# EAGLE design board (EAGLE 9.3.1)
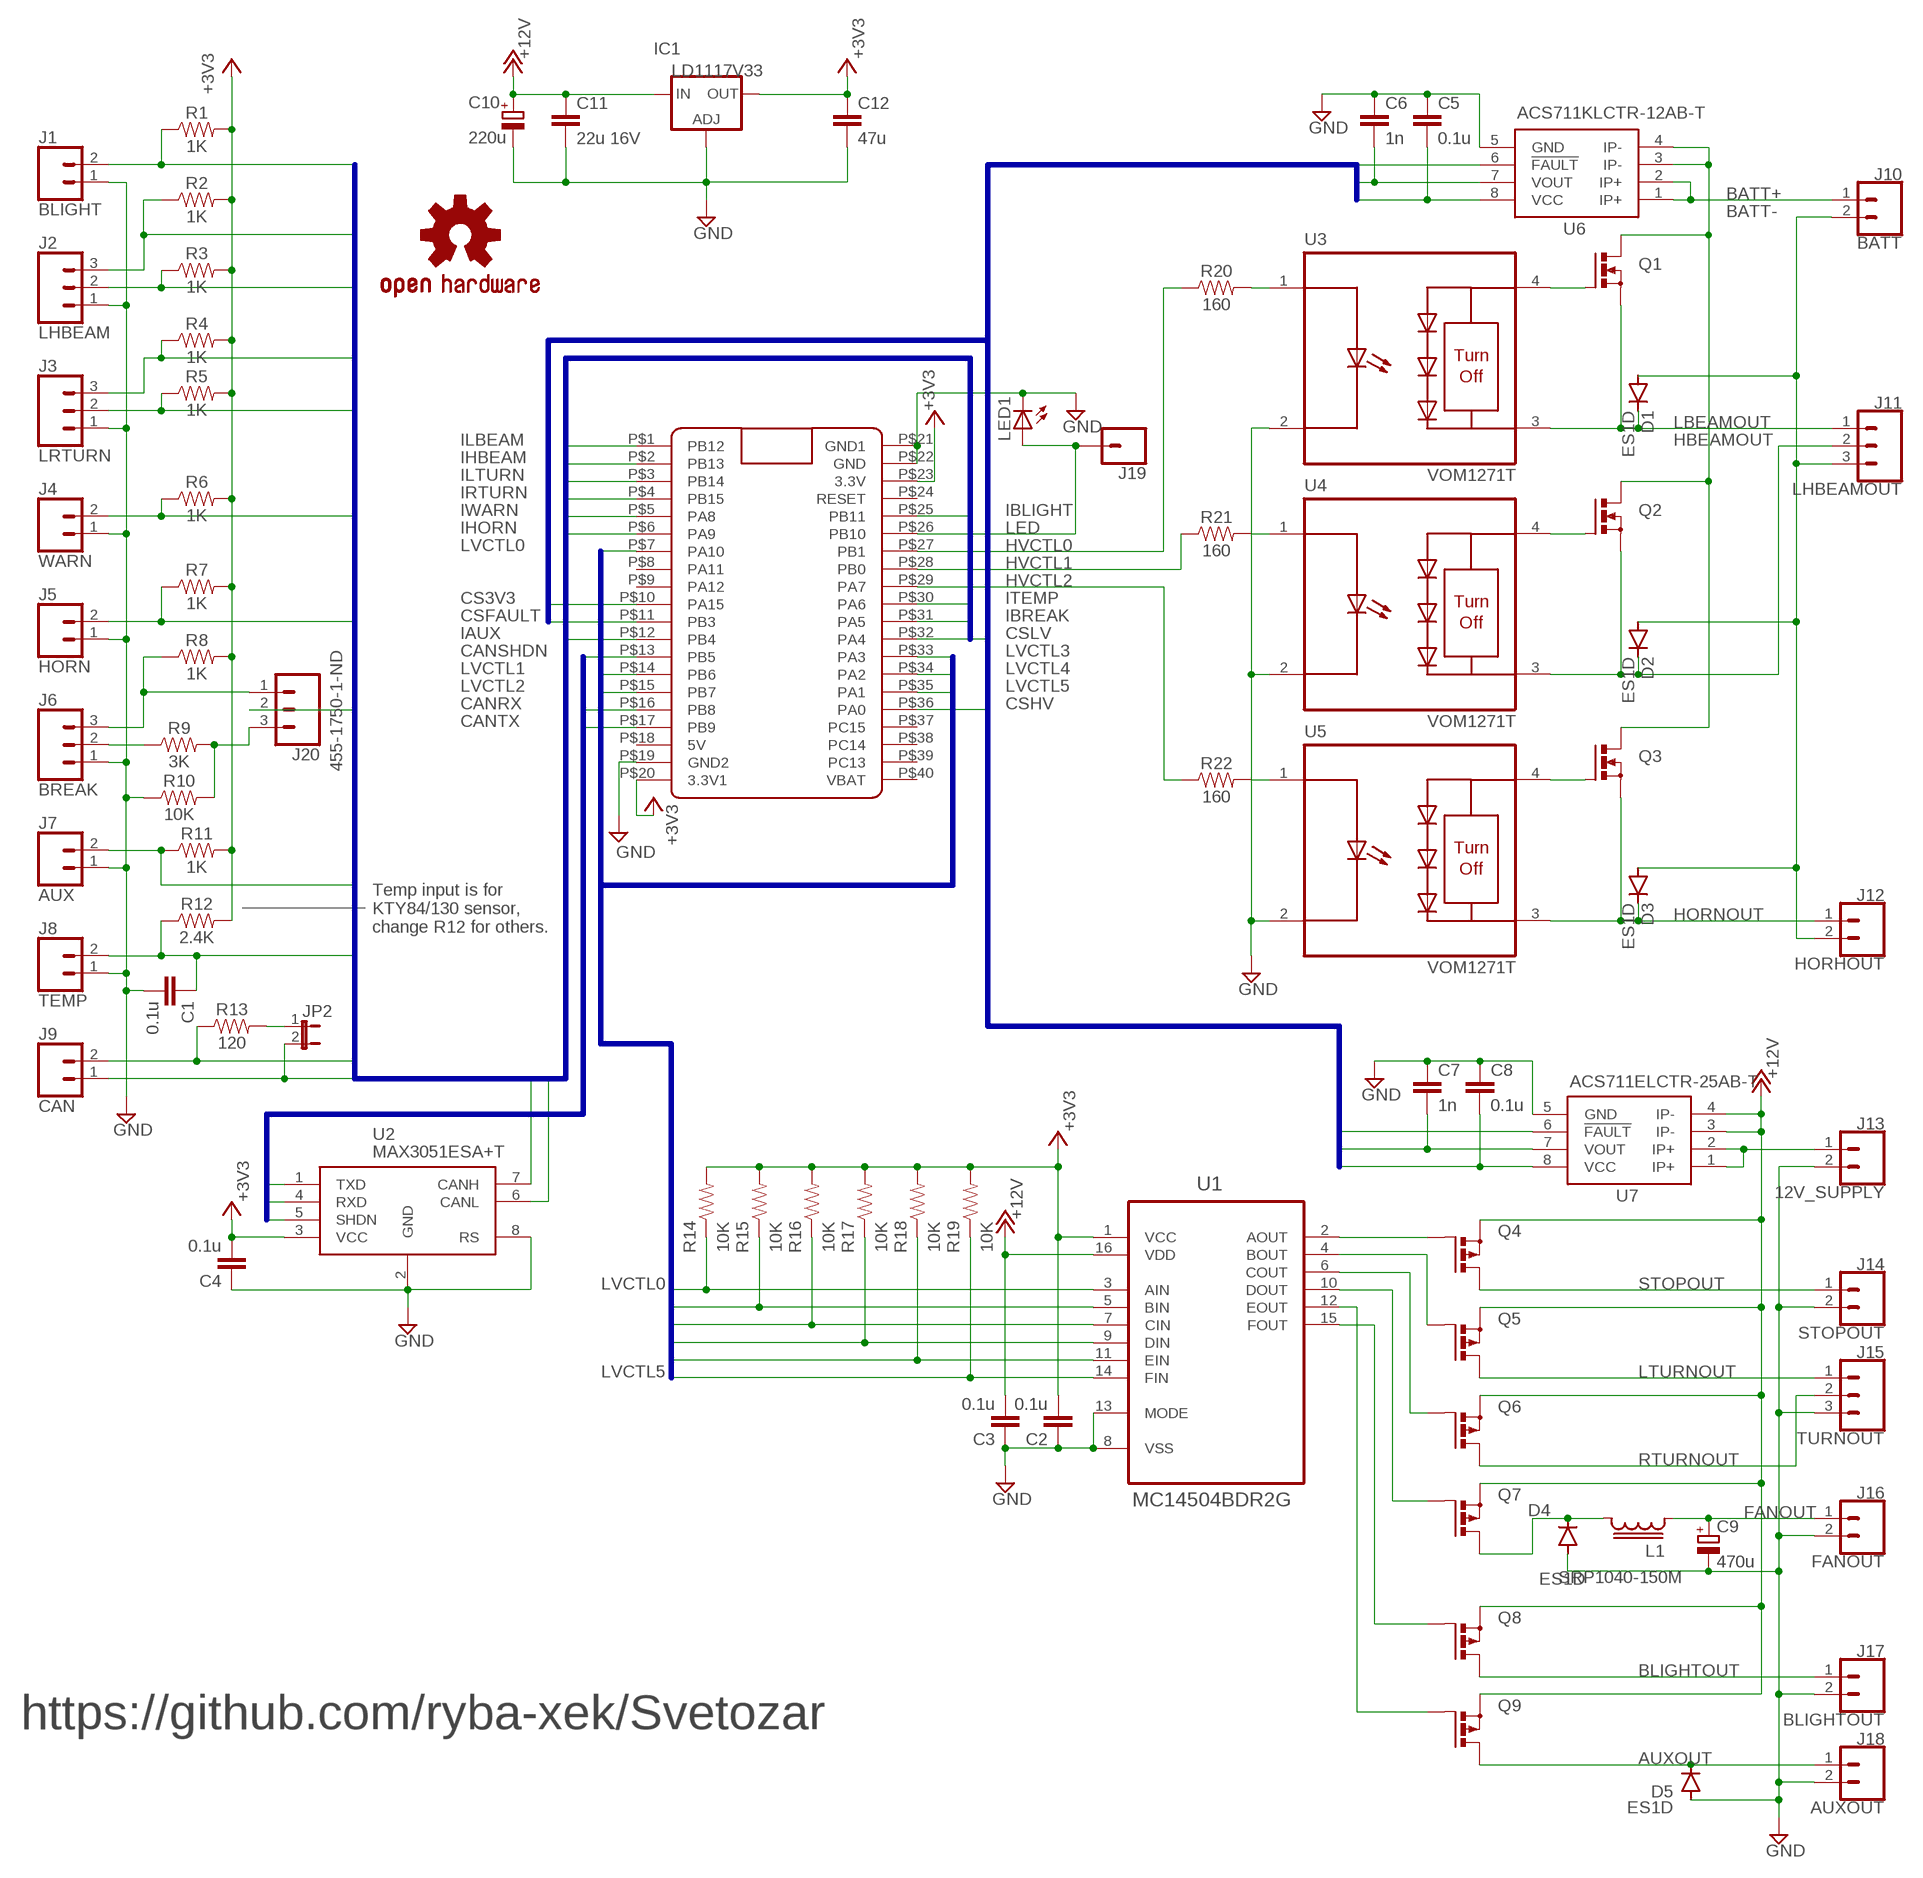
[diagram p0: schematic, sheet 1]

## Parts
C1  0.1u  C-EUC0805  [C0805]
C2  0.1u  C-EUC0805  [C0805]
C3  0.1u  C-EUC1206  [C1206]
C4  0.1u  C-EUC0805  [C0805]
C5  0.1u  C-EUC0805  [C0805]
C6  1n  C-EUC0805  [C0805]
C7  1n  C-EUC0805  [C0805]
C8  0.1u  C-EUC0805  [C0805]
C9  470u  CPOL-EUE3.5-8  [E3,5-8]
C10  220u  CPOL-EUE2.5-6  [E2,5-6]
C11  22u 16V  C-EUC1206  [C1206]
C12  47u  C-EUC1206  [C1206]
D1  ES1D  DIODE-DO214AC  [DO214AC]
D2  ES1D  DIODE-DO214AC  [DO214AC]
D3  ES1D  DIODE-DO214AC  [DO214AC]
D4  ES1D  DIODE-DO214AC  [DO214AC]
D5  ES1D  DIODE-DO214AC  [DO214AC]
IC1  LD1117V33  LD117ADT33TR  [DPACK]
J1  BLIGHT  CONN_023.5MM  [SCREWTERMINAL-3.5MM-2]
J2  LHBEAM  CONN_03SCREW  [SCREWTERMINAL-3.5MM-3]
J3  LRTURN  CONN_03SCREW  [SCREWTERMINAL-3.5MM-3]
J4  WARN  CONN_023.5MM  [SCREWTERMINAL-3.5MM-2]
J5  HORN  CONN_023.5MM  [SCREWTERMINAL-3.5MM-2]
J6  BREAK  CONN_03SCREW  [SCREWTERMINAL-3.5MM-3]
J7  AUX  CONN_023.5MM  [SCREWTERMINAL-3.5MM-2]
J8  TEMP  CONN_023.5MM  [SCREWTERMINAL-3.5MM-2]
J9  CAN  CONN_023.5MM  [SCREWTERMINAL-3.5MM-2]
J10  BATT  CONN_023.5MM  [SCREWTERMINAL-3.5MM-2]
J11  LHBEAMOUT  CONN_03SCREW  [SCREWTERMINAL-3.5MM-3]
J12  HORHOUT  CONN_023.5MM  [SCREWTERMINAL-3.5MM-2]
J13  12V_SUPPLY  CONN_023.5MM  [SCREWTERMINAL-3.5MM-2]
J14  STOPOUT  CONN_023.5MM  [SCREWTERMINAL-3.5MM-2]
J15  TURNOUT  CONN_03SCREW  [SCREWTERMINAL-3.5MM-3]
J16  FANOUT  CONN_023.5MM  [SCREWTERMINAL-3.5MM-2]
J17  BLIGHTOUT  CONN_023.5MM  [SCREWTERMINAL-3.5MM-2]
J18  AUXOUT  CONN_023.5MM  [SCREWTERMINAL-3.5MM-2]
J19  CONN_01  [1X01]
J20  455-1750-1-ND  CONN_03  [1X03]
JP2  JP1E  [JP1]
L1  SRP1040-150M  SRP1040  [SRP1040]
LED1  LEDSML0805  [SML0805]
LOGO1  OSHW-LOGOL  [OSHW-LOGO-L]
Q1  PHP20NQ20T  PMOSFET_NTO220BV  [TO220BV]
Q2  PHP20NQ20T  PMOSFET_NTO220BV  [TO220BV]
Q3  PHP20NQ20T  PMOSFET_NTO220BV  [TO220BV]
Q4  P-MOSFET-SO8  [SO-08]
Q5  P-MOSFET-SO8  [SO-08]
Q6  P-MOSFET-SO8  [SO-08]
Q7  P-MOSFET-SO8  [SO-08]
Q8  P-MOSFET-SO8  [SO-08]
Q9  P-MOSFET-SO8  [SO-08]
R1  1K  RESISTOR0603  [0603]
R2  1K  RESISTOR0603  [0603]
R3  1K  RESISTOR0603  [0603]
R4  1K  RESISTOR0603  [0603]
R5  1K  RESISTOR0603  [0603]
R6  1K  RESISTOR0603  [0603]
R7  1K  RESISTOR0603  [0603]
R8  1K  RESISTOR0603  [0603]
R9  3K  RESISTOR0603  [0603]
R10  10K  RESISTOR0603  [0603]
R11  1K  RESISTOR0603  [0603]
R12  2.4K  RESISTOR0603  [0603]
R13  120  RESISTOR0603  [0603]
R14  10K  RESISTOR0603  [0603]
R15  10K  RESISTOR0603  [0603]
R16  10K  RESISTOR0603  [0603]
R17  10K  RESISTOR0603  [0603]
R18  10K  RESISTOR0603  [0603]
R19  10K  RESISTOR0603  [0603]
R20  160  RESISTOR0603  [0603]
R21  160  RESISTOR0603  [0603]
R22  160  RESISTOR0603  [0603]
U1  MC14504BDR2G  [SOIC127P600X175-16N]
U2  MAX3051ESA+T  [SO-08]
U3  VOM1271T  [SOIC254P695X242-4N]
U4  VOM1271T  [SOIC254P695X242-4N]
U5  VOM1271T  [SOIC254P695X242-4N]
U6  ACS711KLCTR-12AB-T  ACS711  [SO08]
U7  ACS711ELCTR-25AB-T  ACS711  [SO08]
U$1  BLUE_PILL  [BLUE_PILL]

## Nets
12V_IN: J13.1 U7.1(IP+) U7.2(IP+)
+3V3: C2.2 C4.2 C12.1 IC1.4(OUT) R1.2 R2.2 R3.2 R4.2 R5.2 R6.2 R7.2 R8.2 R11.2 R12.2 R14.2 R15.2 R16.2 R17.2 R18.2 R19.2 U1.1(VCC) U2.3(VCC) U$1.P$20(3.3V1) U$1.P$23(3.3V)
+12V: C3.2 C10.+ C11.1 IC1.3(IN) Q4.1(S) Q4.2(S) Q4.3(S) Q5.1(S) Q5.2(S) Q5.3(S) Q6.1(S) Q6.2(S) Q6.3(S) Q7.1(S) Q7.2(S) Q7.3(S) Q8.1(S) Q8.2(S) Q8.3(S) Q9.1(S) Q9.2(S) Q9.3(S) U1.16(VDD) U7.3(IP-) U7.4(IP-)
AUXOUT: D5.C J18.1 Q9.5(D) Q9.6(D) Q9.7(D) Q9.8(D)
BATT+: J10.1 U6.1(IP+) U6.2(IP+)
BATT-: D1.A D2.A D3.A J10.2 J11.3 J12.2
BLIGHTOUT: J17.1 Q8.5(D) Q8.6(D) Q8.7(D) Q8.8(D)
CANH: J9.1 JP2.2 U2.7(CANH)
CANL: J9.2 R13.1 U2.6(CANL)
CANRX: U2.4(RXD) U$1.P$16(PB8)
CANSHDN: U2.5(SHDN) U$1.P$13(PB5)
CANTX: U2.1(TXD) U$1.P$17(PB9)
CS3V3: C5.2 C8.2 U6.8(VCC) U7.8(VCC) U$1.P$10(PA15)
CSFAULT: U6.6(!FAULT) U7.6(!FAULT) U$1.P$11(PB3)
CSHV: C6.2 U6.7(VOUT) U$1.P$36(PA0)
CSLV: C7.2 U7.7(VOUT) U$1.P$32(PA4)
FANOUT: C9.+ J16.1 L1.1
FANPWM: D4.C L1.2 Q7.5(D) Q7.6(D) Q7.7(D) Q7.8(D)
GND: C1.2 C2.1 C3.1 C4.1 C5.1 C6.1 C7.1 C8.1 C9.- C10.- C11.2 C12.2 D4.A D5.A IC1.1(ADJ) J1.1 J2.1 J3.1 J4.1 J5.1 J6.1 J7.1 J8.1 J13.2 J14.2 J15.3 J16.2 J17.2 J18.2 LED1.C R10.1 U1.8(VSS) U1.13(MODE) U2.2(GND) U2.8(RS) U3.2(C1) U4.2(C1) U5.2(C1) U6.5(GND) U7.5(GND) U$1.P$19(GND2) U$1.P$21(GND1) U$1.P$22(GND)
HBEAMOUT: D2.C J11.2 Q2.S U4.3(C2)
HORNOUT: D3.C J12.1 Q3.S U5.3(C2)
HV: Q1.D Q2.D Q3.D U6.3(IP-) U6.4(IP-)
HVCTL0: R20.1 U$1.P$27(PB1)
HVCTL1: R21.1 U$1.P$28(PB0)
HVCTL2: R22.1 U$1.P$29(PA7)
IAUX: J7.2 R11.1 U$1.P$12(PB4)
IBLIGHT: J1.2 R1.1 U$1.P$25(PB11)
IBREAK: J20.2 U$1.P$31(PA5)
IHBEAM: J2.2 R3.1 U$1.P$2(PB13)
IHORN: J5.2 R7.1 U$1.P$6(PA9)
ILBEAM: J2.3 R2.1 U$1.P$1(PB12)
ILTURN: J3.3 R4.1 U$1.P$3(PB14)
IRTURN: J3.2 R5.1 U$1.P$4(PB15)
ITEMP: C1.1 J8.2 R12.1 U$1.P$30(PA6)
IWARN: J4.2 R6.1 U$1.P$5(PA8)
LBEAMOUT: D1.C J11.1 Q1.S U3.3(C2)
LED: J19.1 LED1.A U$1.P$26(PB10)
LTURNOUT: J15.1 Q5.5(D) Q5.6(D) Q5.7(D) Q5.8(D)
LVCTL0: R14.1 U1.3(AIN) U$1.P$7(PA10)
LVCTL1: R15.1 U1.5(BIN) U$1.P$14(PB6)
LVCTL2: R16.1 U1.7(CIN) U$1.P$15(PB7)
LVCTL3: R17.1 U1.9(DIN) U$1.P$33(PA3)
LVCTL4: R18.1 U1.11(EIN) U$1.P$34(PA2)
LVCTL5: R19.1 U1.14(FIN) U$1.P$35(PA1)
LVG0: Q4.4(G) U1.2(AOUT)
LVG1: Q5.4(G) U1.4(BOUT)
LVG2: Q6.4(G) U1.6(COUT)
LVG3: Q7.4(G) U1.10(DOUT)
LVG4: Q8.4(G) U1.15(FOUT)
LVG5: Q9.4(G) U1.12(EOUT)
N$1: J6.3 J20.1 R8.1
N$2: JP2.1 R13.2
N$3: J20.3 R9.2 R10.2
N$4: J6.2 R9.1
N$9: R20.2 U3.1(A1)
N$10: Q1.G U3.4(A2)
N$11: R21.2 U4.1(A1)
N$12: Q2.G U4.4(A2)
N$13: R22.2 U5.1(A1)
N$14: Q3.G U5.4(A2)
RTURNOUT: J15.2 Q6.5(D) Q6.6(D) Q6.7(D) Q6.8(D)
STOPOUT: J14.1 Q4.5(D) Q4.6(D) Q4.7(D) Q4.8(D)
Unconnected: U$1.P$8(PA11) U$1.P$9(PA12) U$1.P$18(5V) U$1.P$24(RESET) U$1.P$37(PC15) U$1.P$38(PC14) U$1.P$39(PC13) U$1.P$40(VBAT)

## Buses
INPUTS:CANH,CANL,IAUX,IBLIGHT,IBREAK,IHBEAM,IHORN,ILBEAM,ILTURN,IRTURN,ITEMP,IWARN
LVCTL:LVCTL[0..5]
CAN:CANRX,CANSHDN,CANTX
CS:CS3V3,CSFAULT,CSHV,CSLV

## Notes on the sheet
- Temp input is for
  KTY84/130 sensor,
  change R12 for others.
- https://github.com/ryba-xek/Svetozar

## Library data of the parts
C1 C2 C4 C5 C8 = rcl:C-EU: CAPACITOR, European symbol; MPN: CC0805KRX7R9BB104; SPICEPREFIX: C
C3 = rcl:C-EU: CAPACITOR, European symbol; MPN: CC1206KRX7R8BB104; SPICEPREFIX: C
C6 C7 = rcl:C-EU: CAPACITOR, European symbol; MPN: CL21B102KBANNNC; SPICEPREFIX: C
C9 = rcl:CPOL-EU: POLARIZED CAPACITOR, European symbol; MPN: SK016M0470B3F-0811; SPICEPREFIX: C
C10 = rcl:CPOL-EU: POLARIZED CAPACITOR, European symbol; MPN: SK016M0220BZF-0611; SPICEPREFIX: C
C11 = rcl:C-EU: CAPACITOR, European symbol; MPN: CL31A226KOHNNNE; SPICEPREFIX: C
C12 = rcl:C-EU: CAPACITOR, European symbol; MPN: CL31A476MQHNNNE; SPICEPREFIX: C
D1-D5 = diode:DIODE-: DIODE; MPN: ES1D
IC1 = v-reg:LD117A?*: Low drop fixed and adjustable positive voltage regulators 1 A Source: http://www.st.com/stonline/products/literature/ds/7194/ld1117axx.pdf; MPN: NCP1117DT33G
J1 J4 J5 J7-J10 J12-J14 J16-J18 = SparkFun-Connectors:CONN_02: Multi connection point. Often used as Generic Header-pin footprint for 0.1 inch spaced/style header connections On any of the 0.1 inch spaced packages, you can populate with these: Break Away Headers - Straight <https://www.sparkfun.com/products/116> (PRT-00116) Break Away Male Headers - Right Angle <https://www.sparkfun.com/products/553> (PRT-00553) Female Headers <https://www.sparkfun.com/products/115> (PRT-00115) Break Away Headers - Machine Pin <https://www.sparkfun.com/products/117> (PRT-00117) Break Away Female Headers - Swiss Machine Pin <https://www.sparkfun.com/products/743> (PRT-00743) For SCREWTERMINALS and SPRING TERMINALS visit here: Screw Terimnals on SparkFun.com <https://www.sparkfun.com/search/results?term=Screw+Terminals> (5mm/3.5mm/2.54mm spacing) This device is also useful as a general connection point to wire up your design to another part of your project. Our various solder wires solder well into these plated through hole pads. Hook-Up Wire - Assortment (Stranded, 22 AWG) <https://www.sparkfun.com/products/11375> (PRT-11375) Hook-Up Wire - Assortment (Solid Core, 22 AWG) <https://www.sparkfun.com/products/11367> (PRT-11367) View the entire wire category on our website here <https://www.sparkfun.com/categories/141> Special notes: Molex polarized connector foot print use with: PRT-08233 with associated crimp pins and housings. 2.54_SCREWTERM for use with PRT-10571. 3.5mm Screw Terminal footprints for PRT-08084 5mm Screw Terminal footprints for use with PRT-08432; MPN: DG350-3.5-02P-14-00AH; PROD_ID: CONN-08399
J2 J3 J6 J11 J15 = SparkFun-Connectors:CONN_03: Multi connection point. Often used as Generic Header-pin footprint for 0.1 inch spaced/style header connections On any of the 0.1 inch spaced packages, you can populate with these: Break Away Headers - Straight <https://www.sparkfun.com/products/116> (PRT-00116) Break Away Male Headers - Right Angle <https://www.sparkfun.com/products/553> (PRT-00553) Female Headers <https://www.sparkfun.com/products/115> (PRT-00115) Break Away Headers - Machine Pin <https://www.sparkfun.com/products/117> (PRT-00117) Break Away Female Headers - Swiss Machine Pin <https://www.sparkfun.com/products/743> (PRT-00743) Stackable Header - 3 Pin (Female, 0.1") <https://www.sparkfun.com/products/13875> (PRT-13875) For SCREWTERMINALS and SPRING TERMINALS visit here: Screw Terimnals on SparkFun.com <https://www.sparkfun.com/search/results?term=Screw+Terminals> (5mm/3.5mm/2.54mm spacing) This device is also useful as a general connection point to wire up your design to another part of your project. Our various solder wires solder well into these plated through hole pads. Hook-Up Wire - Assortment (Stranded, 22 AWG) <https://www.sparkfun.com/products/11375> (PRT-11375) Hook-Up Wire - Assortment (Solid Core, 22 AWG) <https://www.sparkfun.com/products/11367> (PRT-11367) View the entire wire category on our website here <https://www.sparkfun.com/categories/141> Special notes: Molex polarized connector foot print use with SKU : PRT-08232 with associated crimp pins and housings.; MPN: DG350-3.5-03P-14-00AH; PROD_ID: CONN-08288; SF_ID: PRT-08235
J19 = SparkFun-Connectors:CONN_01: Single connection point. Often used as Generic Header-pin footprint for 0.1 inch spaced/style header connections On any of the 0.1 inch spaced packages, you can populate with these: Break Away Headers - Straight <https://www.sparkfun.com/products/116> (PRT-00116) Break Away Male Headers - Right Angle <https://www.sparkfun.com/products/553> (PRT-00553) Female Headers <https://www.sparkfun.com/products/115> (PRT-00115) Break Away Headers - Machine Pin <https://www.sparkfun.com/products/117> (PRT-00117) Break Away Female Headers - Swiss Machine Pin <https://www.sparkfun.com/products/743> (PRT-00743) This device is also useful as a general connection point to wire up your design to another part of your project. Our various solder wires solder well into these plated through hole pads. Hook-Up Wire - Assortment (Stranded, 22 AWG) <https://www.sparkfun.com/products/11375> (PRT-11375) Hook-Up Wire - Assortment (Solid Core, 22 AWG) <https://www.sparkfun.com/products/11367> (PRT-11367) View the entire wire category on our website here <https://www.sparkfun.com/categories/141> Special notes: SMTSO-256-ET is a "flush mount" nut for a 4-40 screw. We mostly use this on specialty testbeds; it is a nice way to connect hardware to your PCB at an adjustable hieght. Also note, the SNAP packages are for using a snappable style connector. We sell a baggie of snaps and they are also used on two LilyPad designs: Snap Assortment - 30 pack (male and female) <https://www.sparkfun.com/products/11347> (DEV-11347) LilyPad Arduino SimpleSnap <https://www.sparkfun.com/products/10941> (DEV-10941) LilyPad SimpleSnap Protoboard <https://www.sparkfun.com/products/10940> (DEV-10940); MPN: PLS-1
J20 = SparkFun-Connectors:CONN_03: Multi connection point. Often used as Generic Header-pin footprint for 0.1 inch spaced/style header connections On any of the 0.1 inch spaced packages, you can populate with these: Break Away Headers - Straight <https://www.sparkfun.com/products/116> (PRT-00116) Break Away Male Headers - Right Angle <https://www.sparkfun.com/products/553> (PRT-00553) Female Headers <https://www.sparkfun.com/products/115> (PRT-00115) Break Away Headers - Machine Pin <https://www.sparkfun.com/products/117> (PRT-00117) Break Away Female Headers - Swiss Machine Pin <https://www.sparkfun.com/products/743> (PRT-00743) Stackable Header - 3 Pin (Female, 0.1") <https://www.sparkfun.com/products/13875> (PRT-13875) For SCREWTERMINALS and SPRING TERMINALS visit here: Screw Terimnals on SparkFun.com <https://www.sparkfun.com/search/results?term=Screw+Terminals> (5mm/3.5mm/2.54mm spacing) This device is also useful as a general connection point to wire up your design to another part of your project. Our various solder wires solder well into these plated through hole pads. Hook-Up Wire - Assortment (Stranded, 22 AWG) <https://www.sparkfun.com/products/11375> (PRT-11375) Hook-Up Wire - Assortment (Solid Core, 22 AWG) <https://www.sparkfun.com/products/11367> (PRT-11367) View the entire wire category on our website here <https://www.sparkfun.com/categories/141> Special notes: Molex polarized connector foot print use with SKU : PRT-08232 with associated crimp pins and housings.; MPN: PLS-3; PROD_ID: XXX-00000
JP2 = jumper:JP1E: JUMPER; MPN: PLS-2
L1 = inductor-bourns:SRP1040: POWER INDUCTOR; MPN: SRP1040-150M
LED1 = led:LED: LED OSRAM: - CHIPLED LG R971, LG N971, LY N971, LG Q971, LY Q971, LO R971, LY R971 LH N974, LH R974 LS Q976, LO Q976, LY Q976 LO Q996 - Hyper CHIPLED LW Q18S LB Q993, LB Q99A, LB R99A - SideLED LS A670, LO A670, LY A670, LG A670, LP A670 LB A673, LV A673, LT A673, LW A673 LH A674 LY A675 LS A676, LA A676, LO A676, LY A676, LW A676 LS A679, LY A679, LG A679 - Hyper Micro SIDELED® LS Y876, LA Y876, LO Y876, LY Y876 LT Y87S - SmartLED LW L88C, LW L88S LB L89C, LB L89S, LG L890 LS L89K, LO L89K, LY L89K LS L896, LA L896, LO L896, LY L896 - TOPLED LS T670, LO T670, LY T670, LG T670, LP T670 LSG T670, LSP T670, LSY T670, LOP T670, LYG T670 LG T671, LOG T671, LSG T671 LB T673, LV T673, LT T673, LW T673 LH T674 LS T676, LA T676, LO T676, LY T676, LB T676, LH T676, LSB T676, LW T676 LB T67C, LV T67C, LT T67C, LS T67K, LO T67K, LY T67K, LW E67C LS E67B, LA E67B, LO E67B, LY E67B, LB E67C, LV E67C, LT E67C LW T67C LS T679, LY T679, LG T679 LS T770, LO T770, LY T770, LG T770, LP T770 LB T773, LV T773, LT T773, LW T773 LH T774 LS E675, LA E675, LY E675, LS T675 LS T776, LA T776, LO T776, LY T776, LB T776 LHGB T686 LT T68C, LB T68C - Hyper Mini TOPLED® LB M676 - Mini TOPLED Santana® LG M470 LS M47K, LO M47K, LY M47K Source: http://www.osram.convergy.de LUXEON: - LUMILED® LXK2-PW12-R00, LXK2-PW12-S00, LXK2-PW14-U00, LXK2-PW14-V00 LXK2-PM12-R00, LXK2-PM12-S00, LXK2-PM14-U00 LXK2-PE12-Q00, LXK2-PE12-R00, LXK2-PE12-S00, LXK2-PE14-T00, LXK2-PE14-U00 LXK2-PB12-K00, LXK2-PB12-L00, LXK2-PB12-M00, LXK2-PB14-N00, LXK2-PB14-P00, LXK2-PB14-Q00 LXK2-PR12-L00, LXK2-PR12-M00, LXK2-PR14-Q00, LXK2-PR14-R00 LXK2-PD12-Q00, LXK2-PD12-R00, LXK2-PD12-S00 LXK2-PH12-R00, LXK2-PH12-S00 LXK2-PL12-P00, LXK2-PL12-Q00, LXK2-PL12-R00 Source: www.luxeon.com KINGBRIGHT: KA-3528ASYC Source: www.kingbright.com; MPN: KPT-2012ZGC
LOGO1 = SparkFun-Aesthetics:OSHW-LOGO: Open-Source Hardware (OSHW) Logo This logo indicates the piece of hardware it is found on incorporates a OSHW license and/or adheres to the definition of open source hardware found here: http://freedomdefined.org/OSHW
Q1-Q3 = transistor-power:PMOSFET_N: Power MOSFET N-Channel; MPN: PHP20NQ20T.127
Q4-Q9 = transistor-power:P-MOSFET-SO8: P-Channel MOSFET Example: FDS4435A; P-Channel Logic Level PowerTrench® MOSFET FDS4465; P-Channel 1.8V Specified PowerTrench® MOSFET Source: www.fairchildsemi.com; MPN: IRF7424TRPBF
R1-R8 R11 = SparkFun-Resistors:RESISTOR: Generic Resistor Package; MPN: RC0603JR-071KL
R9 = SparkFun-Resistors:RESISTOR: Generic Resistor Package; MPN: RC0603JR-073KL
R10 R14-R19 = SparkFun-Resistors:RESISTOR: Generic Resistor Package; MPN: RC0603JR-0710KL
R12 = SparkFun-Resistors:RESISTOR: Generic Resistor Package; MPN: RC0603FR-072K4L
R13 = SparkFun-Resistors:RESISTOR: Generic Resistor Package; MPN: RC0603FR-07120RL
R20-R22 = SparkFun-Resistors:RESISTOR: Generic Resistor Package; MPN: RC0603FR-07160RL
U1 = MC14504BDR2G:MC14504BDR2G: Hex Level Shifter for TTL to CMOS or CMOS to CMOS; AVAILABILITY: Unavailable; DESCRIPTION: MC14504B Series SMT Hex Level Shifter for TTL to CMOS/CMOS to CMOS - SOIC-16; MF: ON Semiconductor; MP: MC14504BDR2G; MPN: MC14504BDR2G; PACKAGE: SOIC-16 ON Semiconductor; PRICE: None
U2 = MAX3051ESA:MAX3051ESA: Can bus transciever Datasheet: http://datasheets.maximintegrated.com/en/ds/MAX3051.pdf; MPN: MAX3051ESA+T
U3-U5 = VOM1271T:VOM1271T; AVAILABILITY: Good; DESCRIPTION: Relay SSR 50mA 1.6V DC-IN 4-Pin SOP T/R; MF: Vishay Semiconductor; MP: VOM1271T; MPN: VOM1271T; PACKAGE: SOP-4 Vishay; PRICE: 1.60 USD
U6 = svetozar:ACS711: ACS711LC Hall-effect-based isolated linear current sensor Datasheet <http://www.allegromicro.com/~/media/Files/Datasheets/ACS711-Datasheet.ashx?la=en>; MPN: ACS711KLCTR-12AB-T; PROD_ID: IC-08964; VALUE: ACS711LC
U7 = svetozar:ACS711: ACS711LC Hall-effect-based isolated linear current sensor Datasheet <http://www.allegromicro.com/~/media/Files/Datasheets/ACS711-Datasheet.ashx?la=en>; MPN: ACS711ELCTR-25AB-T; PROD_ID: IC-08964; VALUE: ACS711LC
U$1 = svetozar:BLUE_PILL

## Net classes
0 default: width 0.3 mm, clearance 0.3 mm

## Board
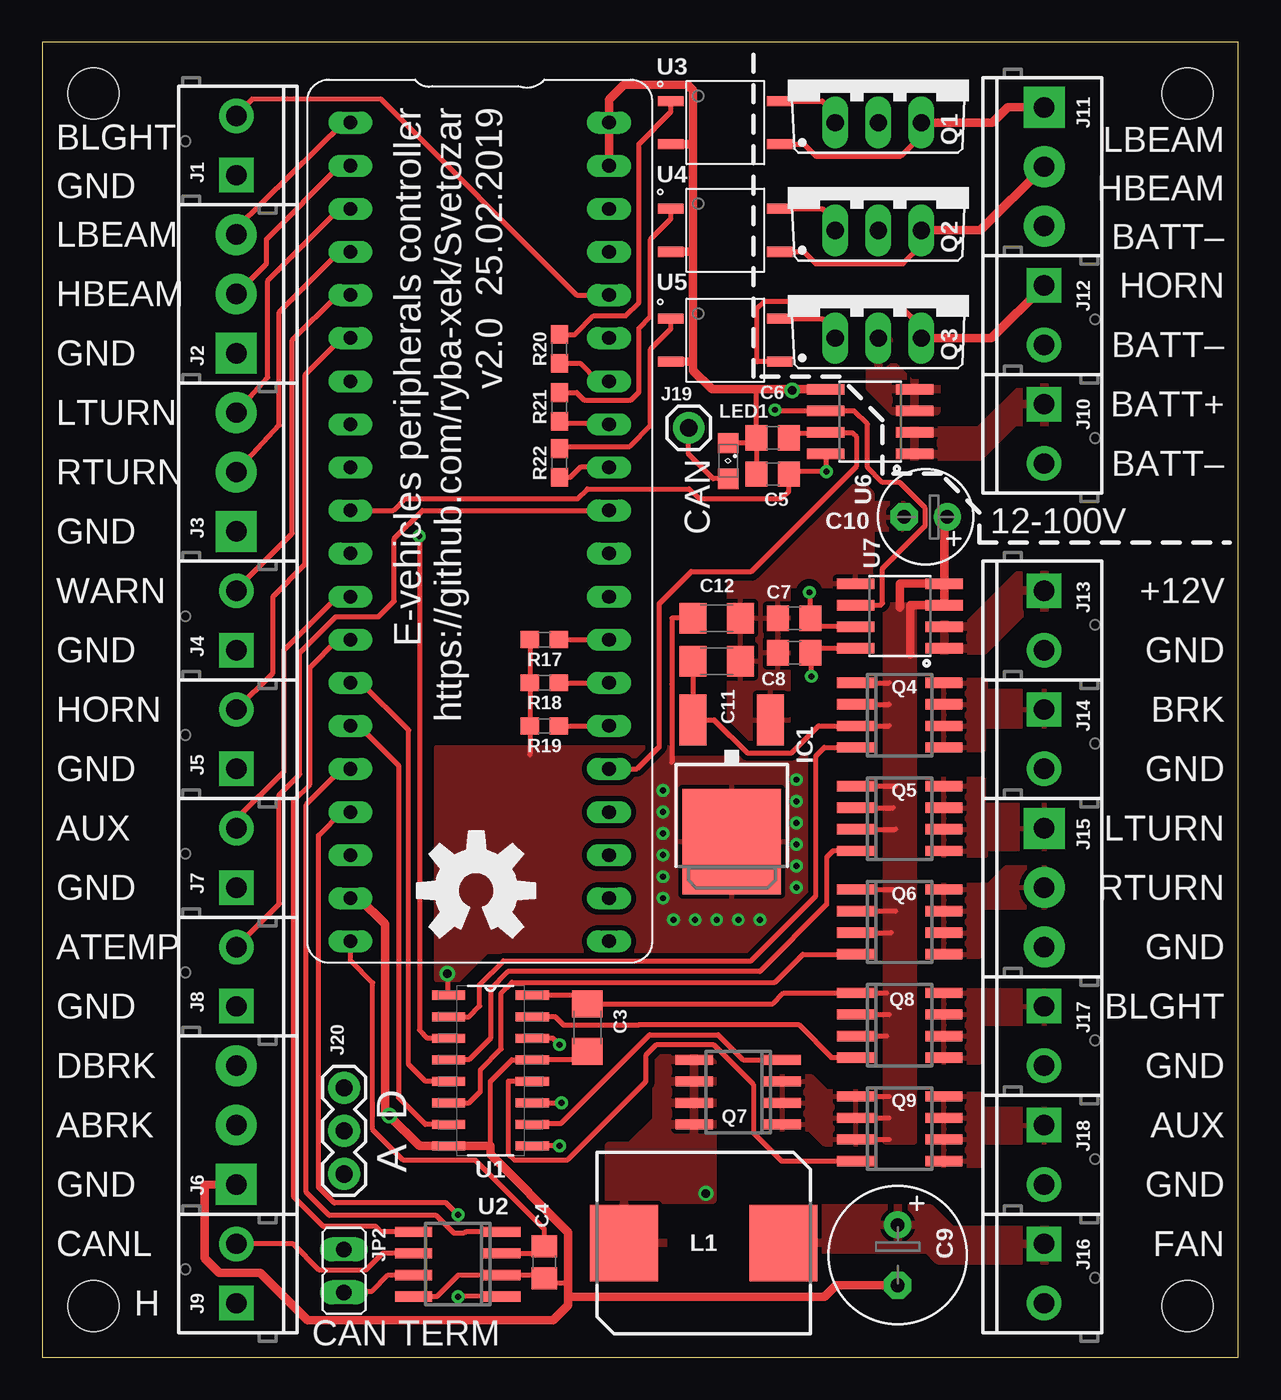
[diagram p1: board, top side]
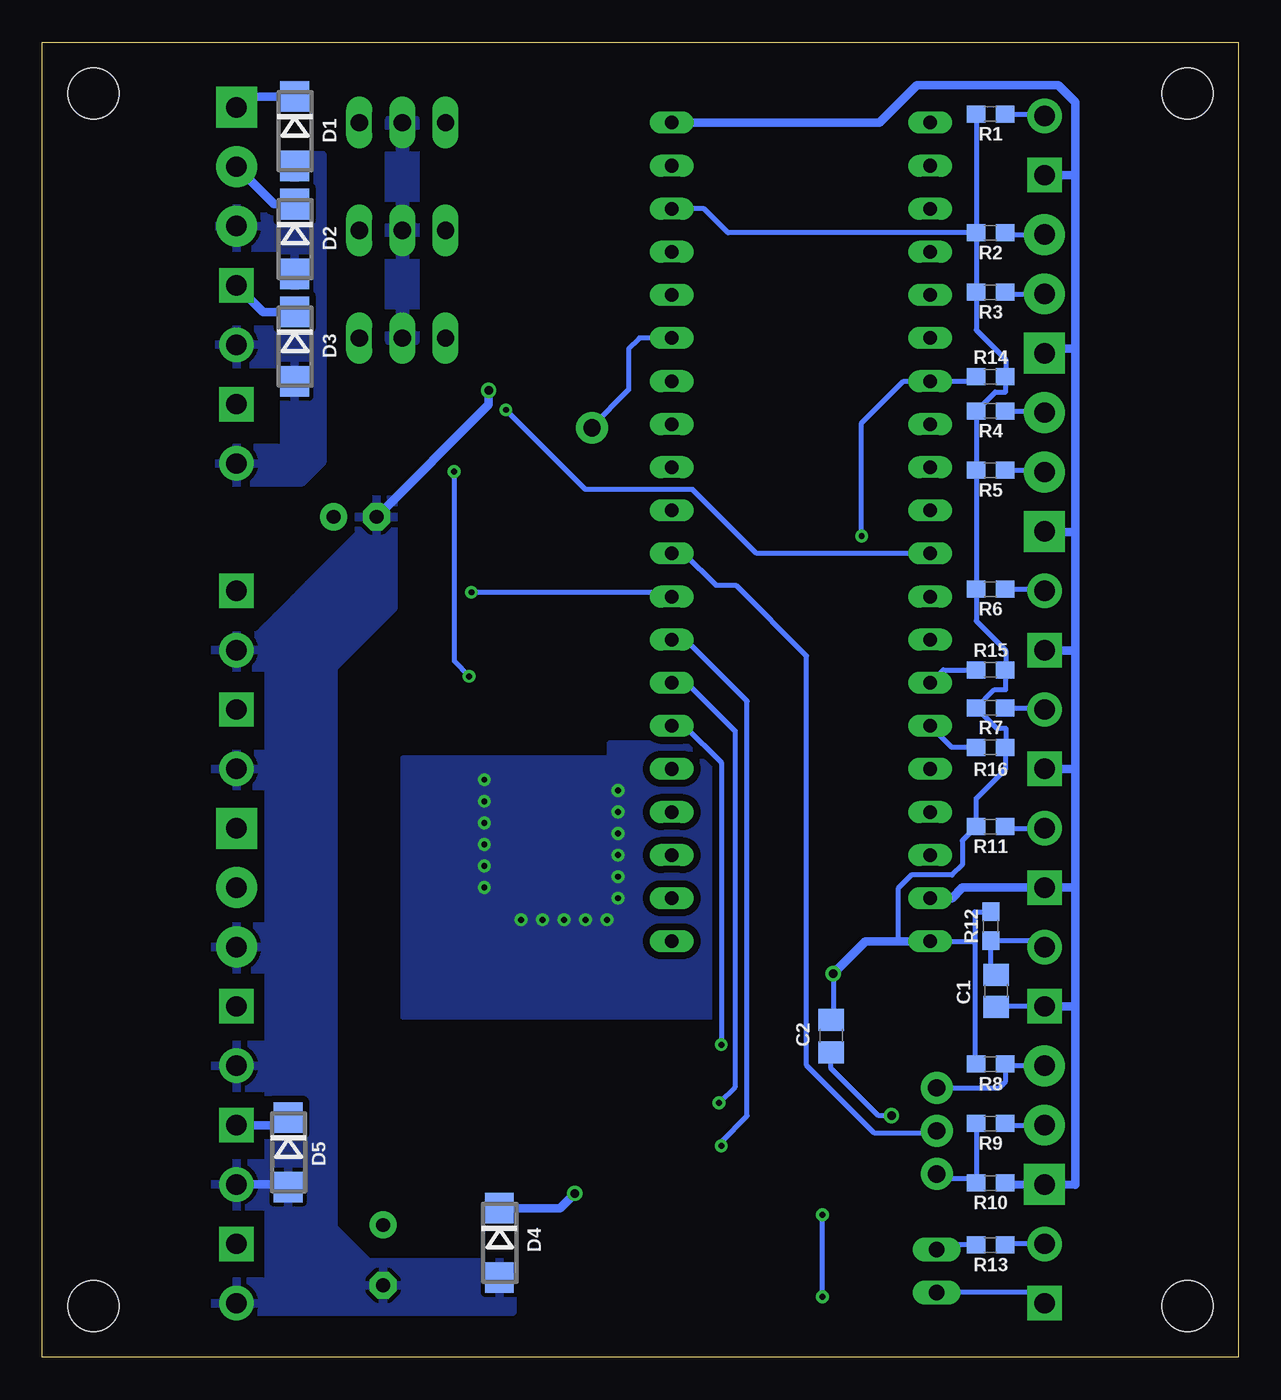
[diagram p2: board, bottom side, seen from below]

Size 70.5 x 77.5 mm. Coordinates in mm from the lower left corner, seen from the top.
Outline: 0,0 70.5,0 70.5,77.5 0,77.5 0,0
Copper layers (1*16): Top 0.035mm / dielectric 1.5mm / Bottom 0.035mm
Design rules "default *": minimum track width 6mil, minimum drill 0.35mm, track to track 6mil, track to pad 6mil, pad to pad 6mil, via to via 6mil, smd to smd 6mil, copper to edge 40mil, drill to drill 6mil, minimum pad ring 10mil, minimum via ring 8mil, stop-mask expansion 4mil, vias tented up to drill 0.6mm, thermal gap 10mil
Holes 3 mm at 3,3 3,74.5 67.5,74.5 67.5,3

### Footprints (pad centres in the part's own frame; a part is rotated, then mirrored left to right if it is on the bottom)
C0805 = smd 1.3 x 1.5: 1 -0.95,0; 2 0.95,0
C1206 = smd 1.6 x 1.8: 1 -1.4,0; 2 1.4,0
E3,5-8 = drill 0.813 pad 1.6: + -1.778,0 | drill 0.813 pad 1.6 octagon: - 1.778,0
E2,5-6 = drill 0.813 pad 1.6: + -1.27,0 | drill 0.813 pad 1.6 octagon: - 1.27,0
DO214AC = smd 1.8 x 1.7: A 2.05,0; C -2.05,0
DPACK = smd 1.6 x 3: 1 -2.28,-4.8; 3 2.28,-4.8 | smd 5.8 x 6.2: 4 0,2.38
SCREWTERMINAL-3.5MM-2 = drill 1.2 pad 2.032 square: 1 0,0 | drill 1.2 pad 2.032: 2 3.5,0
SCREWTERMINAL-3.5MM-3 = drill 1.2 pad 2.413 square: 1 0,0 | drill 1.2 pad 2.413: 2 3.5,0; 3 7,0
1X01 = drill 1.016 pad 1.88: 1 0,0
1X03 = drill 1.016 pad 1.88: 1 0,0; 2 2.54,0; 3 5.08,0
JP1 = drill 0.914 long: 1 0,-1.27; 2 0,1.27
SRP1040 = smd 4 x 4.5: 1 -4.7,0; 2 4.7,0
SML0805 = smd 1.2 x 1.2: A 1.05,0; C -1.05,0
TO220BV = drill 1.016 long: D 0,-2.54; G -2.54,-2.54; S 2.54,-2.54
SO-08 = smd 0.6 x 2.2: 1 -1.905,-2.6; 2 -0.635,-2.6; 3 0.635,-2.6; 4 1.905,-2.6; 5 1.905,2.6; 6 0.635,2.6; 7 -0.635,2.6; 8 -1.905,2.6
0603 = smd 1.1 x 1: 1 -0.85,0; 2 0.85,0
SOIC127P600X175-16N = smd 1.956 x 0.533: 1 -2.464,4.445; 2 -2.464,3.175; 3 -2.464,1.905; 4 -2.464,0.635; 5 -2.464,-0.635; 6 -2.464,-1.905; 7 -2.464,-3.175; 8 -2.464,-4.445; 9 2.464,-4.445; 10 2.464,-3.175; 11 2.464,-1.905; 12 2.464,-0.635; 13 2.464,0.635; 14 2.464,1.905; 15 2.464,3.175; 16 2.464,4.445
SOIC254P695X242-4N = smd 1.5 x 0.6: 1 -3.205,1.27; 2 -3.205,-1.27; 3 3.205,-1.27; 4 3.205,1.27
SO08 = smd 0.61 x 2.21: 1 -1.905,-2.616; 2 -0.635,-2.616; 3 0.635,-2.616; 4 1.905,-2.616; 5 1.905,2.616; 6 0.635,2.616; 7 -0.635,2.616; 8 -1.905,2.616
BLUE_PILL = drill 0.8 long: P$1 -7.62,15.24; P$2 -7.62,12.7; P$3 -7.62,10.16; P$4 -7.62,7.62; P$5 -7.62,5.08; P$6 -7.62,2.54; P$7 -7.62,0; P$8 -7.62,-2.54; P$9 -7.62,-5.08; P$10 -7.62,-7.62; P$11 -7.62,-10.16; P$12 -7.62,-12.7; P$13 -7.62,-15.24; P$14 -7.62,-17.78; P$15 -7.62,-20.32; P$16 -7.62,-22.86; P$17 -7.62,-25.4; P$18 -7.62,-27.94; P$19 -7.62,-30.48; P$20 -7.62,-33.02; P$21 7.62,15.24; P$22 7.62,12.7; P$23 7.62,10.16; P$24 7.62,7.62; P$25 7.62,5.08; P$26 7.62,2.54; P$27 7.62,0; P$28 7.62,-2.54; P$29 7.62,-5.08; P$30 7.62,-7.62; P$31 7.62,-10.16; P$32 7.62,-12.7; P$33 7.62,-15.24; P$34 7.62,-17.78; P$35 7.62,-20.32; P$36 7.62,-22.86; P$37 7.62,-25.4; P$38 7.62,-27.94; P$39 7.62,-30.48; P$40 7.62,-33.02

### Placement (x,y rotation side)
C1  14.28,21.59 270 bottom
C2  24,18.92 90 bottom
C3  32.13,19.43 90 top
C4  29.59,5.59 90 top
C5  43.05,52.05 0 top
C6  43.05,54.18 0 top
C7  44.32,43.56 0 top
C8  44.32,41.53 0 top
C9  50.42,6.01 270 top
C10  52.07,49.53 180 top
C11  39.75,41.02 0 top
C12  39.75,43.56 0 top
D1  55.63,72.26 270 bottom
D2  55.63,65.91 270 bottom
D3  55.63,59.56 270 bottom
D4  43.56,6.73 270 bottom
D5  56.01,12.06 270 bottom
IC1  40.64,32.77 180 top
J1  11.43,69.67 90 top
J2  11.43,59.17 90 top
J3  11.43,48.67 90 top
J4  11.43,41.67 90 top
J5  11.43,34.67 90 top
J6  11.43,10.18 90 top
J7  11.43,27.68 90 top
J8  11.43,20.68 90 top
J9  11.43,3.17 90 top
J10  59.05,56.17 270 top
J11  59.05,73.67 270 top
J12  59.05,63.17 270 top
J13  59.05,45.17 270 top
J14  59.05,38.17 270 top
J15  59.05,31.18 270 top
J16  59.05,6.67 270 top
J17  59.05,20.68 270 top
J18  59.05,13.68 270 top
J19  38.1,54.78 0 top
J20  17.78,15.88 270 top
JP2  17.78,5.08 180 top
L1  38.99,6.73 180 top
LED1  40.43,52.83 270 top
LOGO1  25.57,27.51 0 top
Q1  49.28,75.31 0 top
Q2  49.28,68.96 0 top
Q3  49.28,62.61 0 top
Q4  50.55,37.85 270 top
Q5  50.55,31.75 270 top
Q6  50.55,25.65 270 top
Q7  41.02,15.62 90 top
Q8  50.55,19.56 270 top
Q9  50.55,13.46 270 top
R1  14.61,73.28 180 bottom
R2  14.61,66.28 180 bottom
R3  14.61,62.78 180 bottom
R4  14.61,55.78 180 bottom
R5  14.61,52.28 180 bottom
R6  14.61,45.28 180 bottom
R7  14.61,38.28 180 bottom
R8  14.61,17.28 180 bottom
R9  14.61,13.78 180 bottom
R10  14.61,10.28 180 bottom
R11  14.61,31.28 180 bottom
R12  14.59,25.4 90 bottom
R13  14.61,6.62 180 bottom
R14  14.61,57.78 0 bottom
R15  14.61,40.51 0 bottom
R16  14.61,35.94 0 bottom
R17  29.59,42.29 180 top
R18  29.59,39.75 180 top
R19  29.59,37.21 180 top
R20  30.48,59.44 90 top
R21  30.48,56.01 90 top
R22  30.48,52.7 90 top
U1  26.42,16.89 0 top
U2  24.48,5.48 90 top
U3  40.26,72.77 0 top
U4  40.26,66.42 0 top
U5  40.26,59.94 0 top
U6  48.8,55.14 90 top
U7  50.55,43.69 90 top
U$1  25.78,57.53 0 top

### Tracks (layer width: path | path; a pad name or v marks a point on that pad's centre or on a via)
12V_IN
  pour Top: 52.32,43.18 54.61,43.18 57.53,46.1 59.82,46.1 59.82,44.2 58.04,44.2 55.5,41.66 52.32,41.66
+3V3  (via drill 0.35, 0.5)
  Top 0.3: U2.3 29.16,6.11 C4.2 29.59,7.55 25.54,11.6 21.26,11.6 19.47,13.4 19.47,22.07 18.16,23.38 U$1.P$20 | R17.2 R18.2 R19.2 28.74,35.52 | C12.1 37.1,43.56 37.1,39.67 37.11,39.67 37.11,35.08 | v23.88,22.61 23.88,21.41 U1.1
  Bottom 0.3: R1.2 R2.2 | R2.2 R3.2 15.46,60.54 13.72,58.8 13.72,57.82 R14.2 13.72,57.75 13.72,56.9 14.34,56.9 R4.2 R5.2 R6.2 15.46,43.4 13.72,41.66 13.72,40.55 R15.2 13.72,40.47 13.72,39.35 14.38,39.35 R7.2 14.26,37.08 13.72,37.08 13.72,35.98 R16.2 13.72,35.9 13.72,34.67 15.46,32.93 R11.2 16.28,30.45 16.28,29.01 16.87,28.41 19.27,28.41 20.07,27.61 20.07,24.51 | 15.54,24.51 15.54,26.25 R12.2 | 15.54,24.51 15.54,17.36 R8.2 | U$1.P$20 15.54,24.51 | v23.88,22.61 23.88,20 C2.2 | R2.2 30.08,66.28 31.5,67.69 U$1.P$23
  Bottom 0.5: v23.88,22.61 21.97,24.51 20.07,24.51 U$1.P$20
  other vias: 38.48,25.78 39.75,25.78 41.02,25.78 42.29,25.78 36.58,33.4 36.58,32.13 36.58,30.86 36.58,29.59 36.58,28.32 36.58,27.05 37.21,25.78 44.45,27.69 44.45,28.96 44.45,30.23 44.45,31.5 44.45,32.77 44.45,34.04
  pour Top: 23.24,35.94 37.08,35.94 37.08,35.31 45.47,35.31 45.47,23.88 26.16,23.88 24.51,22.23 23.24,22.23
  pour Bottom (isolate 0.4): 30.99,36.2 37.08,36.2 37.08,35.31 49.28,35.31 49.28,20.07 30.99,20.07
+12V
  Top 0.3: Q9.1 49.91,15.37 | Q9.2 49.91,14.1 | Q9.3 49.91,12.83 | Q5.1 50.29,33.66 | Q5.2 50.16,32.38 | Q5.3 50.29,31.11 | Q6.1 50.16,27.56 | Q6.2 50.29,26.29 | Q8.2 49.91,20.19 | Q8.3 49.78,18.92 | Q6.3 50.04,25.02 | 49.78,21.46 Q8.1 43.69,21.46 43.06,20.83 C3.2 31.63,21.34 U1.16 | 49.91,37.21 Q4.3 45.76,37.21 44.16,35.62 41.55,35.62 39.6,37.57 IC1.3 C11.1 | Q4.2 49.91,38.48 | Q4.1 49.91,39.75
  Top 0.5: 51.18,41.4 51.18,44.32 U7.3 U7.4 | 50.55,44.2 50.55,45.59 U7.4 | U7.4 53.16,49.35 C10.+
  pour Top: 49.66,44.32 49.66,12.7 51.44,12.7 51.44,44.32
  pour Top: 42.67,16.51 42.67,13.46 45.21,13.46 46.1,12.57 48.9,12.57 48.9,15.62 46.23,15.62 45.34,16.51
AUXOUT
  Bottom 0.5: D5.C 56.45,13.68 J18.1
  pour Top: 52.2,15.49 52.2,11.3 55.24,11.3 55.24,12.7 59.82,12.7 59.82,14.61 55.24,14.61 55.24,15.49
BATT+
  pour Top: 50.67,54.61 55.24,54.61 57.78,57.15 59.82,57.15 59.82,55.12 57.28,55.12 55.24,53.09 50.67,53.09
BATT-
  pour Bottom (isolate 0.4): 53.98,70.87 53.98,52.83 55.24,51.56 60.07,51.56 60.07,53.59 56.26,53.59 56.26,58.55 60.07,58.55 60.07,60.58 56.39,60.58 56.39,65.41 60.07,65.41 60.07,67.69 56.39,67.69 56.39,70.87
BLIGHTOUT
  pour Top: 52.2,21.59 52.2,17.4 55.24,17.4 55.24,19.68 59.82,19.68 59.82,21.59
CANH
  Top 0.3: JP2.2 17.86,3.89 19.43,3.89 20.39,4.84 U2.7
  Bottom 0.3: J9.1 12.06,3.81 JP2.2
CANL
  Top 0.3: U2.6 20.04,6.11 19.06,5.12 16.33,5.12 14.78,6.67 J9.2
  Bottom 0.3: J9.2 13.7,6.67 R13.1
CANRX
  Top 0.3: U$1.P$16 17.65,34.67 15.55,32.57 15.55,9.72 16.92,8.36 23.2,8.36 24.26,7.3 24.85,7.3 24.93,7.38 U2.4
CANSHDN
  Top 0.3: U2.5 19.98,7.38 19.66,7.7 16.56,7.7 14.82,9.44 14.82,32.82 15.77,33.76 15.77,40.66 17.4,42.29 U$1.P$13
CANTX  (via drill 0.35)
  Top 0.3: U2.1 24.53,3.57 v24.51,3.56 | v24.51,8.38 23.81,9.08 17.2,9.08 16.28,10.01 16.28,30.75 17.65,32.13 U$1.P$17
  Bottom 0.3: v24.51,3.56 v24.51,8.38
CS3V3  (via drill 0.35)
  Top 0.3: U7.8 45.53,41.78 C8.2 45.34,41.46 v45.34,40.13 | U$1.P$10 20.7,49.91 21.39,50.6 31.55,50.6 32.13,51.18 38.15,51.18 38.73,50.6 43.58,50.6 44,51.03 C5.2 44.28,52.32 44.28,52.2 v46.23,52.2 46.23,53.19 U6.8
  Bottom 0.3: v46.23,52.2 46.23,41.02 v45.34,40.13
CSFAULT  (via drill 0.35)
  Top 0.3: U7.6 49.4,44.32 49.53,44.45 49.53,46.49 52.05,49.01 52.05,50.05 50.54,51.56 49.53,51.56 48.64,52.45 48.64,54.99 47.85,55.78 U6.6 43.24,55.78 v43.18,55.84
  Bottom 0.3: U$1.P$11 28.39,47.37 32.17,51.15 38.49,51.15 v43.18,55.84
CSHV
  Top 0.3: U$1.P$36 35.05,34.67 36.37,35.99 36.37,44.43 38.25,46.31 41.79,46.31 48.01,52.53 48.01,54.23 47.75,54.48 46.21,54.48 U6.7 46.11,54.44 44.26,54.44 C6.2
CSLV  (via drill 0.35)
  Top 0.3: U7.7 45.78,43.05 C7.2 45.27,45.02 v45.21,45.09
  Bottom 0.3: v45.21,45.09 33.66,45.09 U$1.P$32
FANOUT
  pour Top (isolate 0.4): 59.82,5.71 52.83,5.71 52.2,6.35 44.83,6.35 44.83,8.76 52.32,8.76 53.59,7.49 59.82,7.49
FANPWM  (via drill 0.5)
  Bottom 0.5: D4.C 39.99,8.78 v39.12,9.65
  pour Top (isolate 0.4): 39.5,9.27 36.58,9.27 36.58,4.83 33.4,4.83 33.4,12.45 34.67,12.45 36.2,13.97 36.2,18.03 39.5,18.03
GND  (via drill 0.5)
  Top 0.3: C6.1 41.8,53.88 LED1.C | C6.1 C5.1 | 30.99,4.36 29.87,4.36 C4.1 29.39,4.84 U2.2 24.53,4.84 23.26,3.57 U2.8 | C3.1 31.63,17.53 U1.13 27.69,17.53 26.42,16.26 26.42,12.45 | C6.1 42.1,56.99 42.16,57.05
  Top 0.5: U6.5 42.16,57.05 39.47,57.05 38.35,58.17 38.35,58.67 | U$1.P$22 U$1.P$21 33.4,74.12 34.3,75.02 38.03,75.02 38.35,74.7 38.35,71.5 | U$1.P$19 18.67,27.05 20.19,25.53 20.19,14.48 v20.45,14.22 22.23,12.45 U1.8 26.42,12.45 26.42,11.94 30.99,7.37 30.99,4.36 30.99,3.56 | 38.35,65.15 38.35,71.5 | U3.2 38.35,71.5 | U4.2 38.35,65.15 | J6.1 9.55,10.16 9.55,5.81 10.41,4.96 12.82,4.96 15.62,2.16 30.1,2.16 30.99,3.05 30.99,3.56 | 38.35,58.67 38.35,65.15 | U5.2 38.35,58.67 | C9.- 46.78,4.23 46.1,3.56 30.99,3.56
  Bottom 0.3: R10.1 13.72,10.28 | v20.45,14.22 21.21,14.22 24,17.02 C2.1 | J8.1 14.24,20.68 C1.2
  Bottom 0.5: 13.72,10.28 13.6,10.16 J6.1 9.62,10.16 9.62,20.7 | 9.62,69.6 9.62,73.99 10.6,74.97 18.95,74.97 21.15,72.77 U$1.P$21 | 9.62,69.6 9.62,59.44 | 9.62,59.44 9.62,48.64 | 9.62,48.64 9.62,41.66 | 9.62,41.66 9.62,34.67 | 9.62,34.67 9.62,27.69 | 9.62,27.69 9.62,20.7 | J5.1 11.18,34.67 9.62,34.67 | J4.1 11.18,41.66 9.62,41.66 | J3.1 11.18,48.64 9.62,48.64 | J2.1 11.05,59.44 9.62,59.44 | U$1.P$19 16.89,27.05 16.27,27.68 J7.1 9.63,27.68 9.62,27.69 | C10.- 44.2,56.13 v44.2,56.99 | J1.1 9.7,69.67 9.62,69.6 | J18.2 56.17,10.18 D5.A | J8.1 9.64,20.68 9.62,20.7
  pour Top (isolate 0.4): 43.94,35.94 40.51,35.94 40.51,45.59 46.23,51.31 48.51,51.31 48.9,50.93 48.9,50.33 50.76,50.33 51.18,49.91 51.18,49.28 50.67,48.77 48.9,48.77 48.9,45.47 43.94,45.47
  pour Bottom (isolate 0.4): 42.8,5.59 42.8,2.67 60.33,2.67 60.33,4.45 57.15,4.45 57.15,8.89 60.33,8.89 60.33,11.43 57.15,11.43 57.15,15.88 60.33,15.88 60.33,18.41 57.15,18.41 57.15,22.86 60.33,22.86 60.33,25.4 57.15,25.4 57.15,33.66 60.33,33.66 60.33,35.56 57.15,35.56 57.15,40.64 60.33,40.64 60.33,42.55 57.78,42.55 51.82,48.51 51.82,50.55 49.78,50.55 49.78,44.2 53.34,40.64 53.34,7.62 51.31,5.59
HBEAMOUT
  Top 0.3: U4.3 44.9,65.15 45.6,64.45 50.73,64.45 51.82,65.53 Q2.S
  Top 0.5: Q2.S 55.3,66.42 J11.2
  Bottom 0.5: D2.C 56.84,67.96 J11.2
HORNOUT
  Top 0.3: U5.3 42.14,58.67 42.14,61.82 42.56,62.25 50.27,62.25 51.82,60.71 Q3.S
  Top 0.5: J12.1 55.95,60.07 Q3.S
  Bottom 0.5: D3.C 57.49,61.61 J12.1
HV
  pour Top: 52.7,55.75 50.16,55.75 48.77,57.15 48.77,59.94 49.91,59.94 49.91,58.67 51.18,57.4 52.7,57.4
  pour Bottom: 48.64,72.9 48.64,59.94 49.91,59.94 49.91,72.9
HVCTL0
  Top 0.3: U$1.P$27 32.77,57.53 31.71,58.59 R20.1
HVCTL1
  Top 0.3: U$1.P$28 33.36,55.03 30.61,55.03 R21.1
HVCTL2
  Top 0.3: U$1.P$29 31.71,52.45 31.11,51.85 R22.1
IAUX
  Top 0.3: U$1.P$12 17.4,44.83 14.22,41.66 14.22,34.51 11.43,31.71 J7.2
  Bottom 0.3: R11.1 13.65,31.18 J7.2
IBLIGHT
  Top 0.3: J1.2 11.43,73.21 12.39,74.17 19.94,74.17 31.5,62.61 U$1.P$25
  Bottom 0.3: R1.1 11.53,73.28 J1.2
IBREAK
  Bottom 0.3: U$1.P$31 32.67,47.37 30.8,45.5 29.63,45.5 25.46,41.33 25.46,17.2 21.45,13.2 17.92,13.2 J20.2
IHBEAM
  Top 0.3: J2.2 13.21,64.45 13.21,65.91 17.53,70.23 U$1.P$2
  Bottom 0.3: R3.1 13.65,62.67 J2.2
IHORN
  Top 0.3: U$1.P$6 17.65,60.07 15.49,57.91 15.49,46.74 13.59,44.83 13.59,40.33 J5.2
  Bottom 0.3: R7.1 11.53,38.28 J5.2
ILBEAM
  Top 0.3: J2.3 11.43,66.55 17.77,72.77 U$1.P$1
  Bottom 0.3: R2.1 13.65,66.17 J2.3
ILTURN
  Top 0.3: J3.3 13.28,57.75 13.28,63.45 17.53,67.69 U$1.P$3
  Bottom 0.3: R4.1 11.53,55.78 J3.3
IRTURN
  Top 0.3: J3.2 13.97,54.94 13.97,61.59 17.53,65.15 U$1.P$4
  Bottom 0.3: R5.1 11.53,52.28 J3.2
ITEMP
  Top 0.3: J8.2 13.97,26.71 13.97,33.15 15.17,34.35 15.17,41.51 17.3,43.65 19.83,43.65 20.74,44.56 20.74,48.24 22.41,49.91 U$1.P$30
  Bottom 0.3: C1.1 14.59,22.85 R12.1 11.8,24.55 J8.2
IWARN
  Top 0.3: J4.2 11.43,45.26 14.73,48.56 14.73,59.94 17.4,62.61 U$1.P$5
  Bottom 0.3: R6.1 11.53,45.28 J4.2
LBEAMOUT
  Top 0.3: U3.3 44.9,71.5 45.6,70.8 50.6,70.8 51.82,72.01 Q1.S
  Top 0.5: Q1.S 56.02,72.77 56.92,73.67 J11.1
  Bottom 0.5: D1.C 58.42,74.31 J11.1
LED
  Top 0.3: J19.1 38.1,53.22 39.54,51.78 LED1.A
  Bottom 0.3: J19.1 38.1,54.86 35.94,57.02 35.94,59.44 35.31,60.07 U$1.P$26
LTURNOUT
  pour Top: 52.2,34.04 52.2,29.59 55.63,29.59 55.63,29.97 60.07,29.97 60.07,32.51 55.5,32.51 55.5,34.04
LVCTL0  (via drill 0.35)
  Top 0.3: U1.3 22.71,18.8 22.23,19.28 22.23,48.39 v22.2,48.41
  Bottom 0.3: R14.1 15.46,57.53 U$1.P$7 19.74,57.53 22.2,55.07 v22.2,48.41
LVCTL1
  Top 0.3: U1.5 22.58,16.26 21.59,17.25 21.59,36.96 18.8,39.75 U$1.P$14
  Bottom 0.3: U$1.P$14 17.4,40.51 R15.1
LVCTL2
  Top 0.3: U1.7 22.58,13.72 20.99,15.3 20.99,34.89 18.67,37.21 U$1.P$15
  Bottom 0.3: R16.1 16.89,35.94 U$1.P$15
LVCTL3  (via drill 0.35)
  Top 0.3: v30.48,12.45 U1.9 | R17.1 U$1.P$33
  Bottom 0.3: v30.48,12.45 30.48,12.7 28.96,14.22 28.96,38.66 32.58,42.29 U$1.P$33
LVCTL4  (via drill 0.35)
  Top 0.3: U1.11 v30.61,14.99 | R18.1 U$1.P$34
  Bottom 0.3: v30.61,14.99 29.65,15.94 29.65,36.89 32.51,39.75 U$1.P$34
LVCTL5  (via drill 0.35)
  Top 0.3: v30.48,18.41 30.1,18.8 U1.14 | R19.1 U$1.P$35
  Bottom 0.3: v30.48,18.41 30.48,35.05 32.64,37.21 U$1.P$35
LVG0
  Top 0.3: U1.2 25.15,20.07 25.78,20.7 25.78,21.97 27.18,23.37 41.78,23.37 45.59,27.18 45.59,35.43 46.1,35.94 Q4.4
LVG1
  Top 0.3: U1.4 25.15,17.53 26.42,18.8 26.42,21.72 27.43,22.73 42.29,22.73 46.23,26.67 46.23,29.46 46.61,29.84 Q5.4
LVG2
  Top 0.3: U1.6 25.15,14.99 25.82,15.66 25.82,16.93 27.05,18.16 27.05,21.46 27.69,22.1 43.18,22.1 44.83,23.75 Q6.4
LVG3
  Top 0.3: Q7.4 41.31,17.53 39.83,19 35.8,19 30.57,13.78 28.94,13.78 U1.10
LVG4
  Top 0.3: Q8.4 46.55,17.65 44.59,19.6 | U1.15 30.24,20.07 30.72,19.58 35.12,19.58 35.14,19.6 44.59,19.6 | 44.59,19.6
LVG5
  Top 0.3: U1.12 27.45,16.26 27.45,11.99 27.83,11.62 30.95,11.62 35.56,16.23 35.56,17.78 36.18,18.4 39.58,18.4 41.91,16.07 41.91,13.21 43.56,11.56 Q9.4
N$1
  Bottom 0.3: J6.3 13.72,17.16 | R8.1 13.72,17.28 13.72,17.16 | 13.72,17.16 13.72,16.26 14.1,15.88 J20.1
N$2
  Bottom 0.3: R13.2 17.51,6.62 JP2.1
N$3
  Bottom 0.3: R9.2 R10.2 15.71,10.53 17.52,10.53 J20.3
N$4
  Bottom 0.3: R9.1 13.64,13.66 J6.2
N$9
  Top 0.3: U3.1 37.05,73.41 35.16,71.51 35.16,62.15 34.38,61.38 32.49,61.38 31.4,60.29 R20.2
N$10
  Top 0.3: U3.4 45.97,74.04 46.74,73.28 Q1.G
N$11
  Top 0.3: U4.1 37.05,67.11 35.85,65.91 35.85,61.33 35.16,60.63 35.16,56.88 34.71,56.43 31.93,56.43 31.5,56.86 R21.2
N$12
  Top 0.3: U4.4 45.97,67.69 46.74,66.93 Q2.G
N$13
  Top 0.3: U5.1 37.05,60.61 35.85,59.41 35.85,54.9 34.63,53.68 30.61,53.68 R22.2
N$14
  Top 0.3: U5.4 45.97,61.21 46.74,60.45 Q3.G
RTURNOUT
  pour Top: 52.2,27.81 52.2,23.62 55.24,23.62 55.24,26.54 60.07,26.54 60.07,28.83 56.77,28.83 55.75,27.81
STOPOUT
  pour Top: 52.2,39.88 52.2,35.81 55.5,35.81 55.5,37.21 59.82,37.21 59.82,39.24 55.63,39.24 55.63,39.88

### Text on the board
tNames: E-vehicles peripherals controller / https://github.com/ryba-xek/Svetozar / v2.0 25.02.2019 | BLGHT | LBEAM | GND | HBEAM | LBEAM | BATT– | HBEAM | HORN | BATT– | GND | LTURN | BATT+ | CAN | BATT– | RTURN | 12-100V | GND | WARN | +12V | GND | GND | HORN | BRK | GND | GND | AUX | LTURN | GND | RTURN | ATEMP | GND | GND | BLGHT | DBRK | GND | ABRK | AUX | A D | GND | GND | CANL | FAN | H | CAN TERM